# Altium schematic sheet ADC.SchDoc
size A
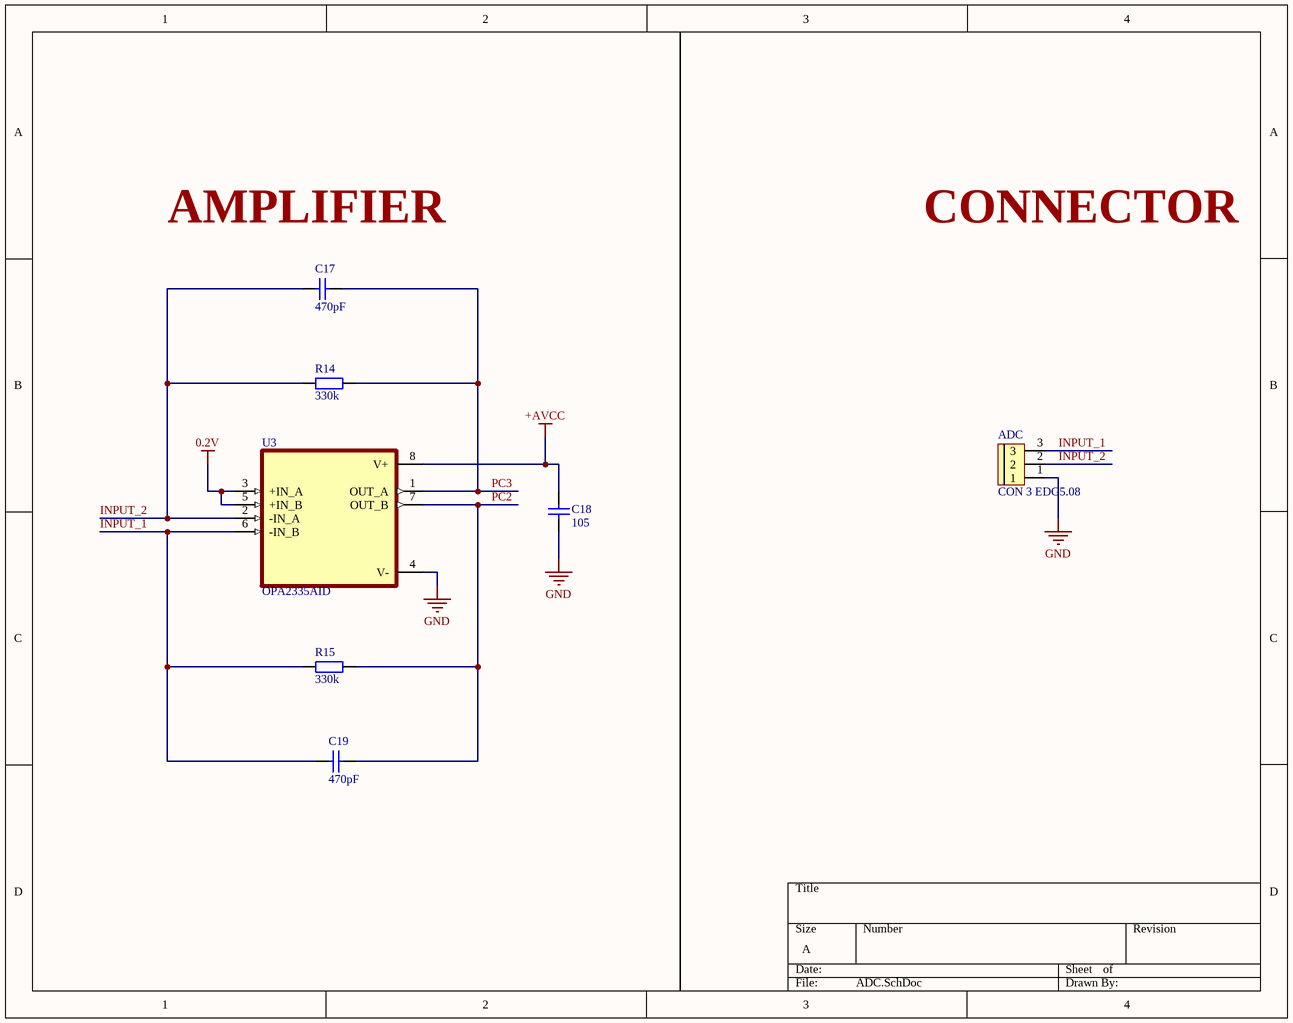
[diagram p0: ADC.SchDoc]

## Parts
ADC  CON 3 EDG5.08  [CON 3 3EDG5.08]
C17  470pF  [tu 0603]
C18  105  [tu 1206]
C19  470pF  [tu 0603]
R14  330k  [Tro SMD 0805]
R15  330k  [Tro SMD 0805]
U3  OPA2335AID  [SOIC127P599X175-8N]

## Nets
0.2V: U3.3(+IN_A) U3.5(+IN_B)
+AVCC: C18.1 U3.8(V+)
GND: ADC.1 C18.2 U3.4(V-)
INPUT_1: ADC.3 C19.2 R15.1 U3.6(-IN_B)
INPUT_2: ADC.2 C17.2 R14.1 U3.2(-IN_A)
PC2: C19.1 R15.2 U3.7(OUT_B)
PC3: C17.1 R14.2 U3.1(OUT_A)

## Notes on the sheet
- AMPLIFIER
- CONNECTOR

## Library data of the parts
ADC = CON 3 EDG5.08: Cắm; Ten_Linh_Kien: CON 3 2EDG5.08-3P 5.08MM ( Xanh Cong); Ma_Hang: MH000760; Ghi_Chu: *; Kieu_Chan: *; Don_Vi: Con; Chung_Loai: Cắm
C17 C19 = Tu 0603 470pF 50V 10%: Dán; Don_Vi: Con; So_Chan: 2; Ten_Linh_Kien: Tụ 0603 470P 50V 10%; Ma_Hang: MH004571; Chung_Loai: Dán; Kieu_Chan: *
C18 = Tu 1206 105 50V 20%: Dán; Don_Vi: Con; So_Chan: 2; Ten_Linh_Kien: Tụ 1206 105-1uF 20% 50V; Ma_Hang: MH004545; Chung_Loai: Dán; Kieu_Chan: *
R14 R15 = Tro 0805 5% 330k: Dán; Don_Vi: Con; So_Chan: 2; Ten_Linh_Kien: Trở 0805 5% 330K; Ma_Hang: MH005336; Chung_Loai: Dán; Kieu_Chan: *
U3 = OPA2335AID: MF: {'manufacturer': u'Texas Instruments'}; Package: None; Price: None; Value: *; MP: OPA2335AID; Availability: Unavailable